# Altium schematic sheet NRF_remote_control_main.SchDoc
size A4
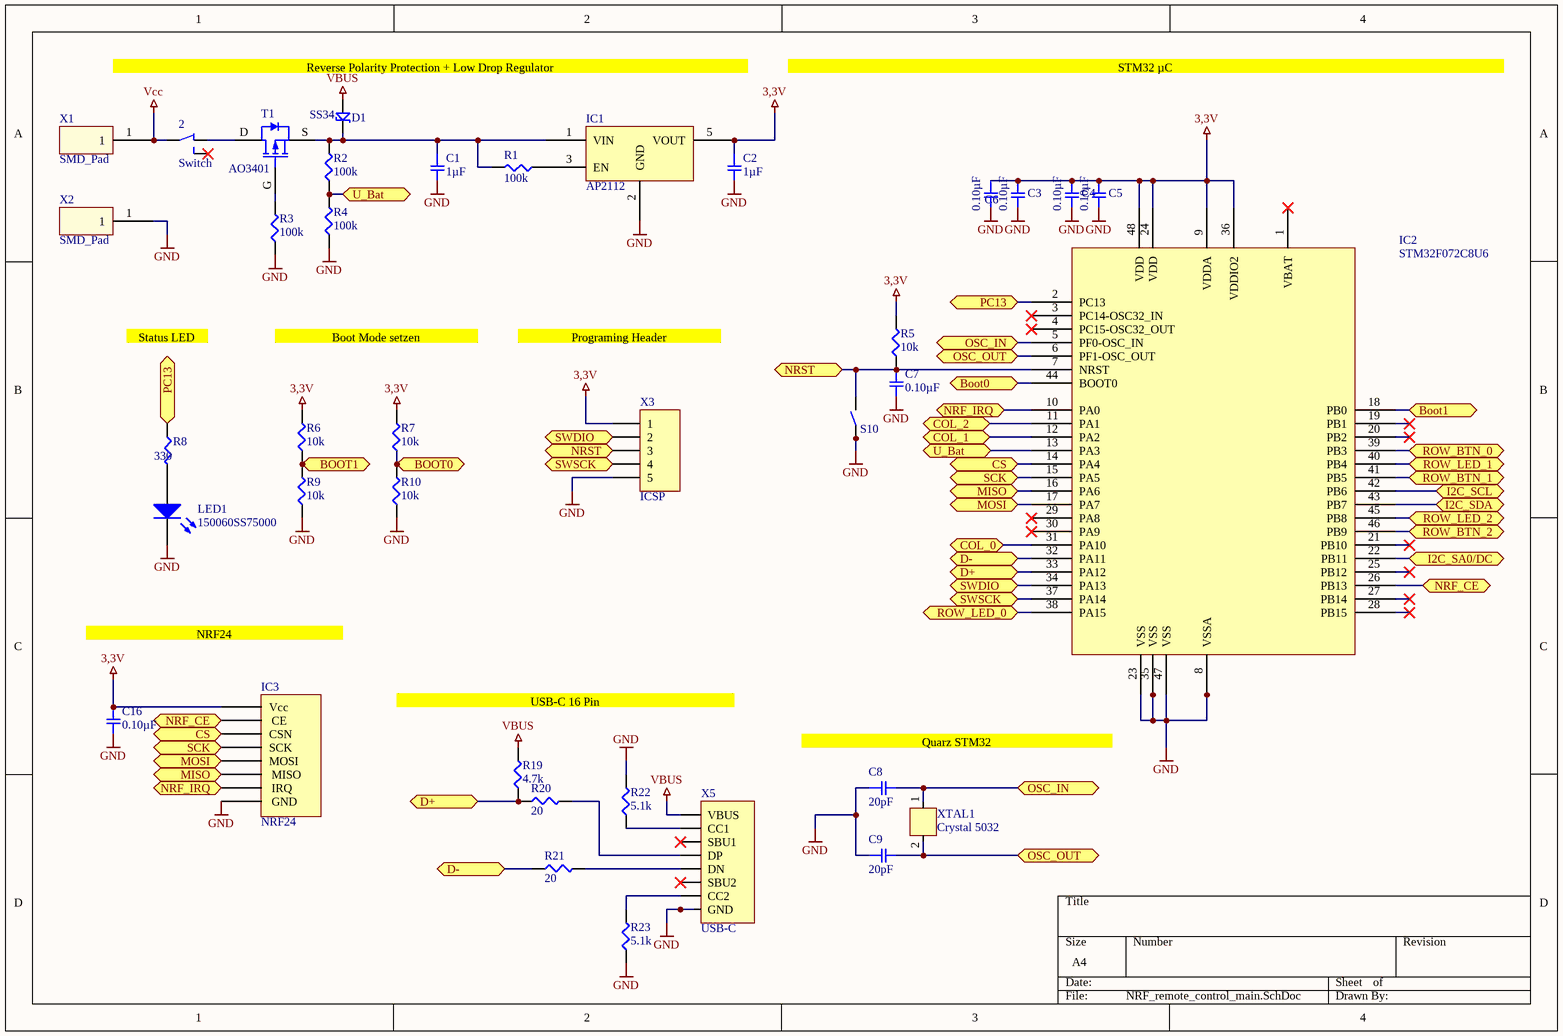
[diagram p0: NRF_remote_control_main.SchDoc]

## Parts
2  Switch  [K3-1296S-J1]
C1  1µF  [SMD-0603C]
C2  1µF  [SMD-0603C]
C3  0.10µF  [SMD-0603C]
C4  0.10µF  [SMD-0603C]
C5  0.10µF  [SMD-0603C]
C6  0.10µF  [SMD-0603C]
C7  0.10µF  [SMD-0603C]
C8  20pF  [SMD-0603C]
C9  20pF  [SMD-0603C]
C16  0.10µF  [SMD-0603C]
D1  SS34  [B240A]
IC1  AP2112  [SOT23-5]
IC2  STM32F072C8U6  [LQFP-48]
IC3  NRF24  [ML01SP4]
LED1  150060SS75000  [0603_A]
R1  100k  [SMD-0603-RES]
R2  100k  [SMD-0603-RES]
R3  100k  [SMD-0603-RES]
R4  100k  [SMD-0603-RES]
R5  10k  [SMD-0603-RES]
R6  10k  [SMD-0603-RES]
R7  10k  [SMD-0603-RES]
R8  330  [SMD-0603-RES]
R9  10k  [SMD-0603-RES]
R10  10k  [SMD-0603-RES]
R19  4.7k  [SMD-0603-RES]
R20  20  [SMD-0603-RES]
R21  20  [SMD-0603-RES]
R22  5.1k  [SMD-0603-RES]
R23  5.1k  [SMD-0603-RES]
S10  Button  [Button5050]  (value not drawn)
T1  AO3401  [SOT23]
X1  SMD_Pad  [SMD_Pad]
X2  SMD_Pad  [SMD_Pad]
X3  ICSP  [TC2030-MCP-NL]
X5  USB-C  [USB-C]
XTAL1  Crystal 5032  [5032]

## Ports
Boot0 (bidir), BOOT0 (bidir), Boot1 (bidir), BOOT1 (bidir), COL_0 (bidir), COL_1 (bidir), COL_2 (bidir), CS (bidir), D+ (bidir), D- (bidir), I2C_SA0/DC (bidir), I2C_SCL (bidir), I2C_SDA (bidir), MISO (bidir), MOSI (bidir), NRF_CE (bidir), NRF_IRQ (bidir), NRST (bidir), OSC_IN (bidir), OSC_OUT (bidir), PC13 (bidir), ROW_BTN_0 (bidir), ROW_BTN_1 (bidir), ROW_BTN_2 (bidir), ROW_LED_0 (bidir), ROW_LED_1 (bidir), ROW_LED_2 (bidir), SCK (bidir), SWDIO (bidir), SWSCK (bidir), U_Bat (bidir)

## Nets
3,3V: C2.1 C3.1 C4.1 C5.1 C6.1 C16.1 IC1.5(VOUT) IC2.9(VDDA) IC2.24(VDD) IC2.36(VDDIO2) IC2.48(VDD) IC3.Vcc R5.2 R6.2 R7.2 X3.1
GND: C1.2 C2.2 C3.2 C4.2 C5.2 C6.2 C7.2 C8.1 C9.1 C16.2 IC1.2(GND) IC2.8(VSSA) IC2.23(VSS) IC2.35(VSS) IC2.47(VSS) IC3.Gnd(GND) LED1.1(K) R3.1 R4.1 R9.1 R10.1 R22.2 R23.1 S10.1 X2.1 X3.5 X5.GND
VBUS: D1.A R19.2 X5.VBUS
Vcc: 2.3 X1.1
Boot0: IC2.44(BOOT0) R7.1 R10.2 ; port Boot0, port BOOT0
Boot1: IC2.18(PB0) R6.1 R9.2 ; port Boot1, port BOOT1
COL_0: IC2.31(PA10) ; port COL_0
COL_1: IC2.12(PA2) ; port COL_1
COL_2: IC2.11(PA1) ; port COL_2
CS: IC2.14(PA4) IC3.CSN ; port CS
D+: IC2.33(PA12) R19.1 R20.1 ; port D+
D-: IC2.32(PA11) R21.1 ; port D-
I2C_SA0/DC: IC2.22(PB11) ; port I2C_SA0/DC
I2C_SCL: IC2.42(PB6) ; port I2C_SCL
I2C_SDA: IC2.43(PB7) ; port I2C_SDA
MISO: IC2.16(PA6) IC3.MISO ; port MISO
MOSI: IC2.17(PA7) IC3.MOSI ; port MOSI
NRF_CE: IC2.26(PB13) IC3.CE ; port NRF_CE
NRF_IRQ: IC2.10(PA0) IC3.IRQ ; port NRF_IRQ
NRST: C7.1 IC2.7(NRST) R5.1 S10.2 X3.3 ; port NRST
OSC_IN: C8.2 IC2.5(PF0-OSC_IN) XTAL1.1 ; port OSC_IN
OSC_OUT: C9.2 IC2.6(PF1-OSC_OUT) XTAL1.2 ; port OSC_OUT
PC13: IC2.2(PC13) R8.1 ; port PC13
ROW_BTN_0: IC2.39(PB3) ; port ROW_BTN_0
ROW_BTN_1: IC2.41(PB5) ; port ROW_BTN_1
ROW_BTN_2: IC2.46(PB9) ; port ROW_BTN_2
ROW_LED_0: IC2.38(PA15) ; port ROW_LED_0
ROW_LED_1: IC2.40(PB4) ; port ROW_LED_1
ROW_LED_2: IC2.45(PB8) ; port ROW_LED_2
SCK: IC2.15(PA5) IC3.SCK ; port SCK
SWDIO: IC2.34(PA13) X3.2 ; port SWDIO
SWSCK: IC2.37(PA14) X3.4 ; port SWSCK
U_Bat: IC2.13(PA3) R2.1 R4.2 ; port U_Bat
Net2_1: 2.1 T1.D
NetC1_1: C1.1 D1.K IC1.1(VIN) R1.2 R2.2 T1.S
NetIC1_3: IC1.3(EN) R1.1
NetLED1_2: LED1.2(A) R8.2
NetR3_2: R3.2 T1.G
NetR20_2: R20.2 X5.DP
NetR21_2: R21.2 X5.DN
NetR22_1: R22.1 X5.CC1
NetR23_2: R23.2 X5.CC2

Not connected (* = marked no-connect by the designer): 2 2*; IC2 1(VBAT)* 3(PC14-OSC32_IN)* 4(PC15-OSC32_OUT)* 19(PB1)* 20(PB2)* 21(PB10)* 25(PB12)* 27(PB14)* 28(PB15)* 29(PA8)* 30(PA9)*; X5 SBU1*

## Notes on the sheet
- (near D1) Reverse Polarity Protection + Low Drop Regulator
- STM32 µC
  STM32 µC
- Status LED
- Boot Mode setzen
- Programing Header
- NRF24
- USB-C 16 Pin
- Quarz STM32

## Library data of the parts
C1 C2 = GCM188R71C105KA64D: CAP CER 1UF 16V X7R 0603; Manufacturer: Murata Electronics North America; Factory Stock: 0; Unit Price (USD): 0.24; Minimum Quantity: 1; Tolerance: ±10%; Datasheets: http://www.murata.com/~/media/webrenewal/support/library/catalog/products/capacitor/mlcc/c03e.ashx; Image: //media.digikey.com/Renders/Murata%20Renders/0603%28GCM188%29.jpg; Digi-Key Part Number: 490-5241-1-ND; Part Number: GCM188R71C105KA64D; Quantity Available: 9243; @ qty: 0; Packaging: Cut Tape (CT); Series: GCM; Part Status: Active; Value: 1µF; Voltage: 16V; Temperature Coefficient: X7R; Operating Temperature: -55°C ~ 125°C; Features: -; Ratings: AEC-Q200; Applications: Automotive; Mounting Type: Surface Mount, MLCC; Package / Case: 0603 (1608 Metric); Size / Dimension: 0.063" L x 0.031" W (1.60mm x 0.80mm); Height - Seated (Max): -; Thickness (Max): 0.035" (0.90mm); Lead Spacing: -; Lead Style: -
C3-C9 C16 = GCM188R71C104KA37J: CAP CER 0.1UF 16V X7R 0603; Manufacturer: Murata Electronics North America; Factory Stock: 0; Unit Price (USD): 0.18; Minimum Quantity: 1; Tolerance: ±10%; Datasheets: http://www.murata.com/~/media/webrenewal/support/library/catalog/products/capacitor/mlcc/c03e.ashx; Image: //media.digikey.com/Renders/Murata%20Renders/0603%28GCM188%29.jpg; Digi-Key Part Number: 490-8015-1-ND; Part Number: GCM188R71C104KA37J; Quantity Available: 17844; @ qty: 0; Packaging: Cut Tape (CT); Series: GCM; Part Status: Active; Voltage: 16V; Temperature Coefficient: X7R; Operating Temperature: -55°C ~ 125°C; Features: -; Ratings: AEC-Q200; Applications: Automotive; Mounting Type: Surface Mount, MLCC; Package / Case: 0603 (1608 Metric); Size / Dimension: 0.063" L x 0.031" W (1.60mm x 0.80mm); Height - Seated (Max): -; Thickness (Max): 0.035" (0.90mm); Lead Spacing: -; Lead Style: -
  C3-C7 C16: Value: 0.10µF
  C8 C9: Value: 20pF
D1 = B240A: Shottkydiode
LED1 = 150060SS75000: SMD mono-color Chip LED, WL-SMCW, Super Red; PackageReference: 0603_A; Color: Super Red; PartNumber: 150060SS75000; ComponentLink1Description: Manufacturer URL; ComponentLink1URL: http://www.we-online.com; ComponentLink2Description: Datasheet; ComponentLink2URL: http://katalog.we-online.com/led/datasheet/150060SS75000.pdf
R1-R4 R19 = ERJ-3EKF4701V: RES SMD 4.7K OHM 1% 1/10W 0603; Manufacturer: Panasonic Electronic Components; Factory Stock: 0; Unit Price (USD): 0.00379; @ qty: 1500; Minimum Quantity: 1; Power (Watts): 0.1W, 1/10W; Temperature Coefficient: ±100ppm/°C; Part Number: ERJ-3EKF4701V; Datasheets: http://industrial.panasonic.com/www-cgi/jvcr13pz.cgi?E+PZ+3+AOA0002+ERJ3EKF4701V+7+WW; Image: //media.digikey.com/Photos/Panasonic%20Photos/MFG_ERJ-P6W%20Series.jpg; Digi-Key Part Number: P4.70KHCT-ND; Quantity Available: 999380; Packaging: Cut Tape (CT); Series: ERJ; Part Status: Active; Tolerance: ±1%; Composition: Thick Film; Features: Automotive AEC-Q200; Operating Temperature: -55°C ~ 155°C; Package / Case: 0603 (1608 Metric); Supplier Device Package: 0603; Size / Dimension: 0.063" L x 0.031" W (1.60mm x 0.80mm); Height - Seated (Max): 0.022" (0.55mm); Number of Terminations: 2; Failure Rate: -
  R1-R4: Value: 100k
  R19: Value: 4.7k
R5-R7 R9 R10 = ERJ-3EKF1002V: RES SMD 10K OHM 1% 1/10W 0603; Manufacturer: Panasonic Electronic Components; Factory Stock: 0; Unit Price (USD): 0.00379; @ qty: 1500; Minimum Quantity: 1; Power (Watts): 0.1W, 1/10W; Temperature Coefficient: ±100ppm/°C; Part Number: ERJ-3EKF1002V; Datasheets: http://industrial.panasonic.com/www-cgi/jvcr13pz.cgi?E+PZ+3+AOA0002+ERJ3EKF1002V+7+WW; Image: //media.digikey.com/Photos/Panasonic%20Photos/MFG_ERJ-P6W%20Series.jpg; Digi-Key Part Number: P10.0KHCT-ND; Quantity Available: 6703141; Packaging: Cut Tape (CT); Series: ERJ; Part Status: Active; Value: 10k; Tolerance: ±1%; Composition: Thick Film; Features: Automotive AEC-Q200; Operating Temperature: -55°C ~ 155°C; Package / Case: 0603 (1608 Metric); Supplier Device Package: 0603; Size / Dimension: 0.063" L x 0.031" W (1.60mm x 0.80mm); Height - Seated (Max): 0.022" (0.55mm); Number of Terminations: 2; Failure Rate: -
R8 = ERJ-3EKF3300V: RES SMD 330 OHM 1% 1/10W 0603; Manufacturer: Panasonic Electronic Components; Factory Stock: 0; Unit Price (USD): 0.00379; @ qty: 1500; Minimum Quantity: 1; Power (Watts): 0.1W, 1/10W; Temperature Coefficient: ±100ppm/°C; Part Number: ERJ-3EKF3300V; Datasheets: http://industrial.panasonic.com/www-cgi/jvcr13pz.cgi?E+PZ+3+AOA0002+ERJ3EKF3300V+7+WW; Image: //media.digikey.com/Photos/Panasonic%20Photos/MFG_ERJ-P6W%20Series.jpg; Digi-Key Part Number: P330HCT-ND; Quantity Available: 670984; Packaging: Cut Tape (CT); Series: ERJ; Part Status: Active; Value: 330; Tolerance: ±1%; Composition: Thick Film; Features: Automotive AEC-Q200; Operating Temperature: -55°C ~ 155°C; Package / Case: 0603 (1608 Metric); Supplier Device Package: 0603; Size / Dimension: 0.063" L x 0.031" W (1.60mm x 0.80mm); Height - Seated (Max): 0.022" (0.55mm); Number of Terminations: 2; Failure Rate: -
R20 R21 = ERJ-3EKF20R0V: RES SMD 20 OHM 1% 1/10W 0603; Manufacturer: Panasonic Electronic Components; Factory Stock: 0; Unit Price (USD): 0.00379; @ qty: 1500; Minimum Quantity: 1; Power (Watts): 0.1W, 1/10W; Temperature Coefficient: ±100ppm/°C; Part Number: ERJ-3EKF20R0V; Datasheets: http://industrial.panasonic.com/www-cgi/jvcr13pz.cgi?E+PZ+3+AOA0002+ERJ3EKF20R0V+7+WW; Image: //media.digikey.com/Photos/Panasonic%20Photos/MFG_ERJ-P6W%20Series.jpg; Digi-Key Part Number: P20.0HCT-ND; Quantity Available: 92419; Packaging: Cut Tape (CT); Series: ERJ; Part Status: Active; Value: 20; Tolerance: ±1%; Composition: Thick Film; Features: Automotive AEC-Q200; Operating Temperature: -55°C ~ 155°C; Package / Case: 0603 (1608 Metric); Supplier Device Package: 0603; Size / Dimension: 0.063" L x 0.031" W (1.60mm x 0.80mm); Height - Seated (Max): 0.022" (0.55mm); Number of Terminations: 2; Failure Rate: -
R22 R23 = ERJ-3GEYJ512V: RES SMD 5.1K OHM 5% 1/10W 0603; Manufacturer: Panasonic Electronic Components; Factory Stock: 0; Unit Price (USD): 0.00321; @ qty: 1500; Minimum Quantity: 1; Power (Watts): 0.1W, 1/10W; Temperature Coefficient: ±200ppm/°C; Part Number: ERJ-3GEYJ512V; Datasheets: http://industrial.panasonic.com/www-cgi/jvcr13pz.cgi?E+PZ+3+AOA0001+ERJ3GEYJ512V+7+WW; Image: //media.digikey.com/Photos/Panasonic%20Photos/MFG_ERJ-P6W%20Series.jpg; Digi-Key Part Number: P5.1KGCT-ND; Quantity Available: 285626; Packaging: Cut Tape (CT); Series: ERJ; Part Status: Active; Value: 5.1k; Tolerance: ±5%; Composition: Thick Film; Features: Automotive AEC-Q200; Operating Temperature: -55°C ~ 155°C; Package / Case: 0603 (1608 Metric); Supplier Device Package: 0603; Size / Dimension: 0.063" L x 0.031" W (1.60mm x 0.80mm); Height - Seated (Max): 0.022" (0.55mm); Number of Terminations: 2; Failure Rate: -
S10 = Button: 6.1x3.7x2.5mm
T1 = AO3401: AO3401 MOSFET 30V
X5 = USB-C 16P
XTAL1 = 5032